# EAGLE design MEMS_BMI (EAGLE 7.6.0)

## Sheet 1 of 4: power
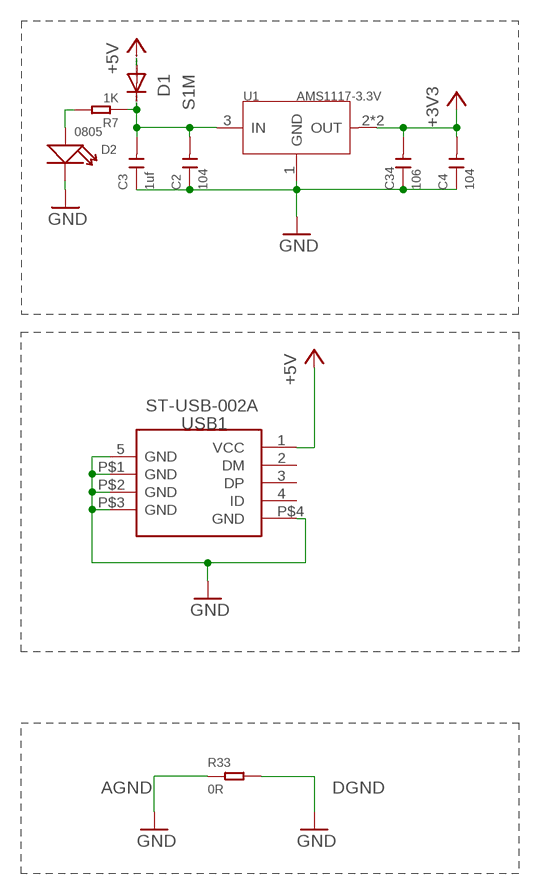
[diagram p0: schematic, sheet 1]

### Parts
C2  104  CAP-(0603)  [C0603]
C3  1uf  CERAMIC-1UF-25V-10%-X7R(0805)  [C0805]
C4  104  CAP-(0603)  [C0603]
C34  106  CERAMIC-1UF-25V-10%-X7R(0805)  [C0805]
D1  S1M  [SMA]
D2  0805  SMD-LED-CLEAR-RED(0805)  [LED-0805]
R7  1K  RES-(0603)  [R0603]
R33  0R  RES-(0603)  [R0603]
U1  AMS1117-3.3V  PMIC-CJT1117-3.3(SOT223)  [SOT-223]
USB1  ST-USB-002A  MINI-USB-RCPT-B-5PS-R/A-SMD(ST-USB-002A)  [MINIUSB5+4P-SMD-0.8-90D]

### Nets
+3V3: C4.2 C34.2 U1.2(OUT) U1.TER(OUT) ; also sheet 2,3
+5V: D1.A USB1.1(VCC)
GND: C2.1 C3.1 C4.1 C34.1 D2.- R33.1 R33.2 U1.1(GND) USB1.5(GND) USB1.P$1(GND) USB1.P$2(GND) USB1.P$3(GND) USB1.P$4(GND) ; also sheet 2,3,4
N$4: C2.2 C3.2 D1.C R7.1 U1.3(IN)
N$12: D2.+ R7.2
Unconnected: USB1.2(DM) USB1.3(DP) USB1.4(ID)

### Notes on the sheet
- AGND | DGND

## Sheet 2 of 4: main
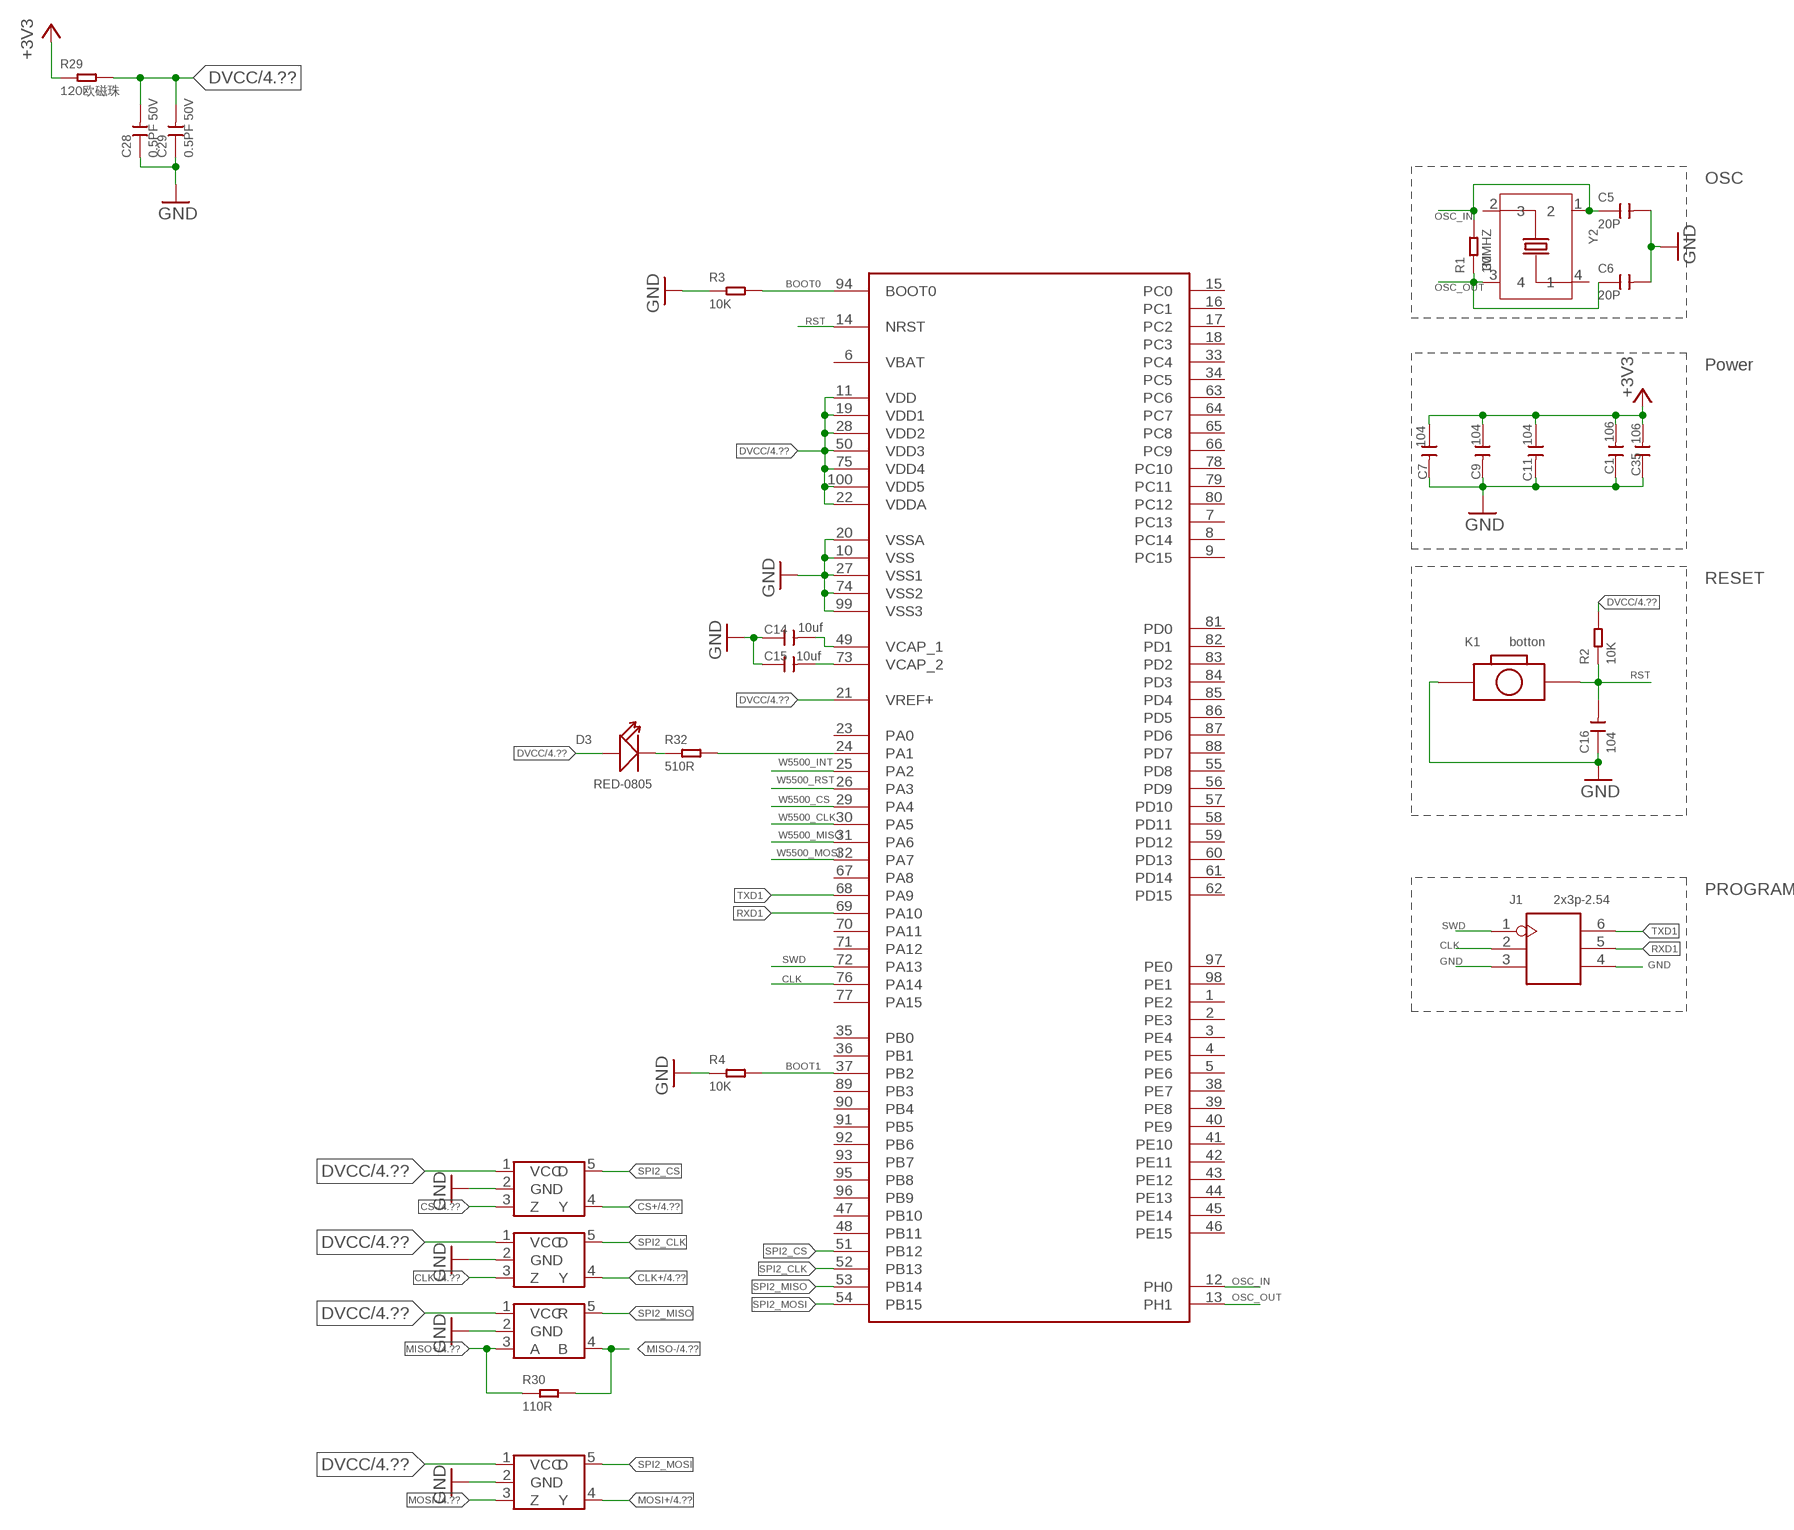
[diagram p1: schematic, sheet 2]

### Parts
C1  106  CERAMIC-1UF-25V-10%-X7R(0805)  [C0805]
C5  20P  CAP-(0603)  [C0603]
C6  20P  CAP-(0603)  [C0603]
C7  104  CAP-(0603)  [C0603]
C9  104  CAP-(0603)  [C0603]
C11  104  CAP-(0603)  [C0603]
C14  10uf  CERAMIC-1UF-25V-10%-X7R(0805)  [C0805]
C15  10uf  CERAMIC-1UF-25V-10%-X7R(0805)  [C0805]
C16  104  CAP-(0603)  [C0603]
C28  0.5PF 50V  CAP-(0603)  [C0603]
C29  0.5PF 50V  CAP-(0603)  [C0603]
C35  106  CERAMIC-1UF-25V-10%-X7R(0805)  [C0805]
D3  RED-0805  SMD-LED-CLEAR-RED(0805)  [LED-0805]
J1  2x3p-2.54  DIP-BLACK-FEMALE-HEADER-VERT(2X3P-2.54)  [H2X3-2.54]
K1  botton  SMD-BUTTON  [SW2-SMD-3.0X6.0*2.5]
LVDS1-1  SN65LVDS1  [DBV_R-PDSO-G5]
LVDS1-2  SN65LVDS1  [DBV_R-PDSO-G5]
LVDS1-3  SN65LVDS1  [DBV_R-PDSO-G5]
R1  1M  RES-(0603)  [R0603]
R2  10K  RES-(0603)  [R0603]
R3  10K  RES-(0603)  [R0603]
R4  10K  RES-(0603)  [R0603]
R29  120欧磁珠  RES-(0603)  [R0603]
R30  110R  RES-(0603)  [R0603]
R32  510R  RES-(0603)  [R0603]
U$1  STM32F40XSTM32D40X  [LQFP100]
U$2  SN65LVDS2  [DBV_R-PDSO-G5]
Y2  30MHZ  SMD-CRYSTAL-30MHZ-10PF-10PPM-60R(4P-3.2X2.5MM)  [X4-SMD-3.2X2.5X0.7MM]

### Nets
+3V3: C1.2 C7.1 C9.1 C11.1 C35.2 R29.1 ; also sheet 1,3
BOOT0: R3.2 U$1.94(BOOT0)
BOOT1: R4.2 U$1.37(PB2)
CLK: J1.2 U$1.76(PA14)
CLK+: LVDS1-2.4(Y) ; also sheet 4
CLK-: LVDS1-2.3(Z) ; also sheet 4
CS+: LVDS1-1.4(Y) ; also sheet 4
CS-: LVDS1-1.3(Z) ; also sheet 4
DVCC: C28.2 C29.2 D3.+ LVDS1-1.1(VCC) LVDS1-2.1(VCC) LVDS1-3.1(VCC) R2.2 R29.2 U$1.11(VDD) U$1.19(VDD1) U$1.21(VREF+) U$1.22(VDDA) U$1.28(VDD2) U$1.50(VDD3) U$1.75(VDD4) U$1.100(VDD5) U$2.1(VCC) ; also sheet 4
GND: C1.1 C5.2 C6.2 C7.2 C9.2 C11.2 C14.1 C15.1 C16.1 C28.1 C29.1 C35.1 J1.3 J1.4 K1.1 LVDS1-1.2(GND) LVDS1-2.2(GND) LVDS1-3.2(GND) R3.1 R4.1 U$1.10(VSS) U$1.20(VSSA) U$1.27(VSS1) U$1.74(VSS2) U$1.99(VSS3) U$2.2(GND) ; also sheet 1,3,4
MISO+: R30.1 U$2.3(A) ; also sheet 4
MISO-: R30.2 U$2.4(B) ; also sheet 4
MOSI+: LVDS1-3.4(Y) ; also sheet 4
MOSI-: LVDS1-3.3(Z) ; also sheet 4
N$1: C15.2 U$1.73(VCAP_2)
N$8: C14.2 U$1.49(VCAP_1)
N$26: D3.- R32.1
N$28: R32.2 U$1.24(PA1)
OSC_IN: C5.1 R1.2 U$1.12(PH0) Y2.1
OSC_OUT: C6.1 R1.1 U$1.13(PH1) Y2.3
RST: C16.2 K1.2 R2.1 U$1.14(NRST)
RXD1: J1.5 U$1.69(PA10)
SPI2_CLK: LVDS1-2.5(D) U$1.52(PB13)
SPI2_CS: LVDS1-1.5(D) U$1.51(PB12)
SPI2_MISO: U$1.53(PB14) U$2.5(R)
SPI2_MOSI: LVDS1-3.5(D) U$1.54(PB15)
SWD: J1.1 U$1.72(PA13)
TXD1: J1.6 U$1.68(PA9)
W5500_CLK: U$1.30(PA5) ; also sheet 3
W5500_CS: U$1.29(PA4) ; also sheet 3
W5500_INT: U$1.25(PA2) ; also sheet 3
W5500_MISO: U$1.31(PA6) ; also sheet 3
W5500_MOSI: U$1.32(PA7) ; also sheet 3
W5500_RST: U$1.26(PA3) ; also sheet 3
Unconnected: U$1.1(PE2) U$1.2(PE3) U$1.3(PE4) U$1.4(PE5) U$1.5(PE6) U$1.6(VBAT) U$1.7(PC13) U$1.8(PC14) U$1.9(PC15) U$1.15(PC0) U$1.16(PC1) U$1.17(PC2) U$1.18(PC3) U$1.23(PA0) U$1.33(PC4) U$1.34(PC5) U$1.35(PB0) U$1.36(PB1) U$1.38(PE7) U$1.39(PE8) U$1.40(PE9) U$1.41(PE10) U$1.42(PE11) U$1.43(PE12) U$1.44(PE13) U$1.45(PE14) U$1.46(PE15) U$1.47(PB10) U$1.48(PB11) U$1.55(PD8) U$1.56(PD9) U$1.57(PD10) U$1.58(PD11) U$1.59(PD12) U$1.60(PD13) U$1.61(PD14) U$1.62(PD15) U$1.63(PC6) U$1.64(PC7) U$1.65(PC8) U$1.66(PC9) U$1.67(PA8) U$1.70(PA11) U$1.71(PA12) U$1.77(PA15) U$1.78(PC10) U$1.79(PC11) U$1.80(PC12) U$1.81(PD0) U$1.82(PD1) U$1.83(PD2) U$1.84(PD3) U$1.85(PD4) U$1.86(PD5) U$1.87(PD6) U$1.88(PD7) U$1.89(PB3) U$1.90(PB4) U$1.91(PB5) U$1.92(PB6) U$1.93(PB7) U$1.95(PB8) U$1.96(PB9) U$1.97(PE0) U$1.98(PE1) Y2.2 Y2.4

### Notes on the sheet
- OSC
- Power
- RESET
- PROGRAM

## Sheet 3 of 4: W5500
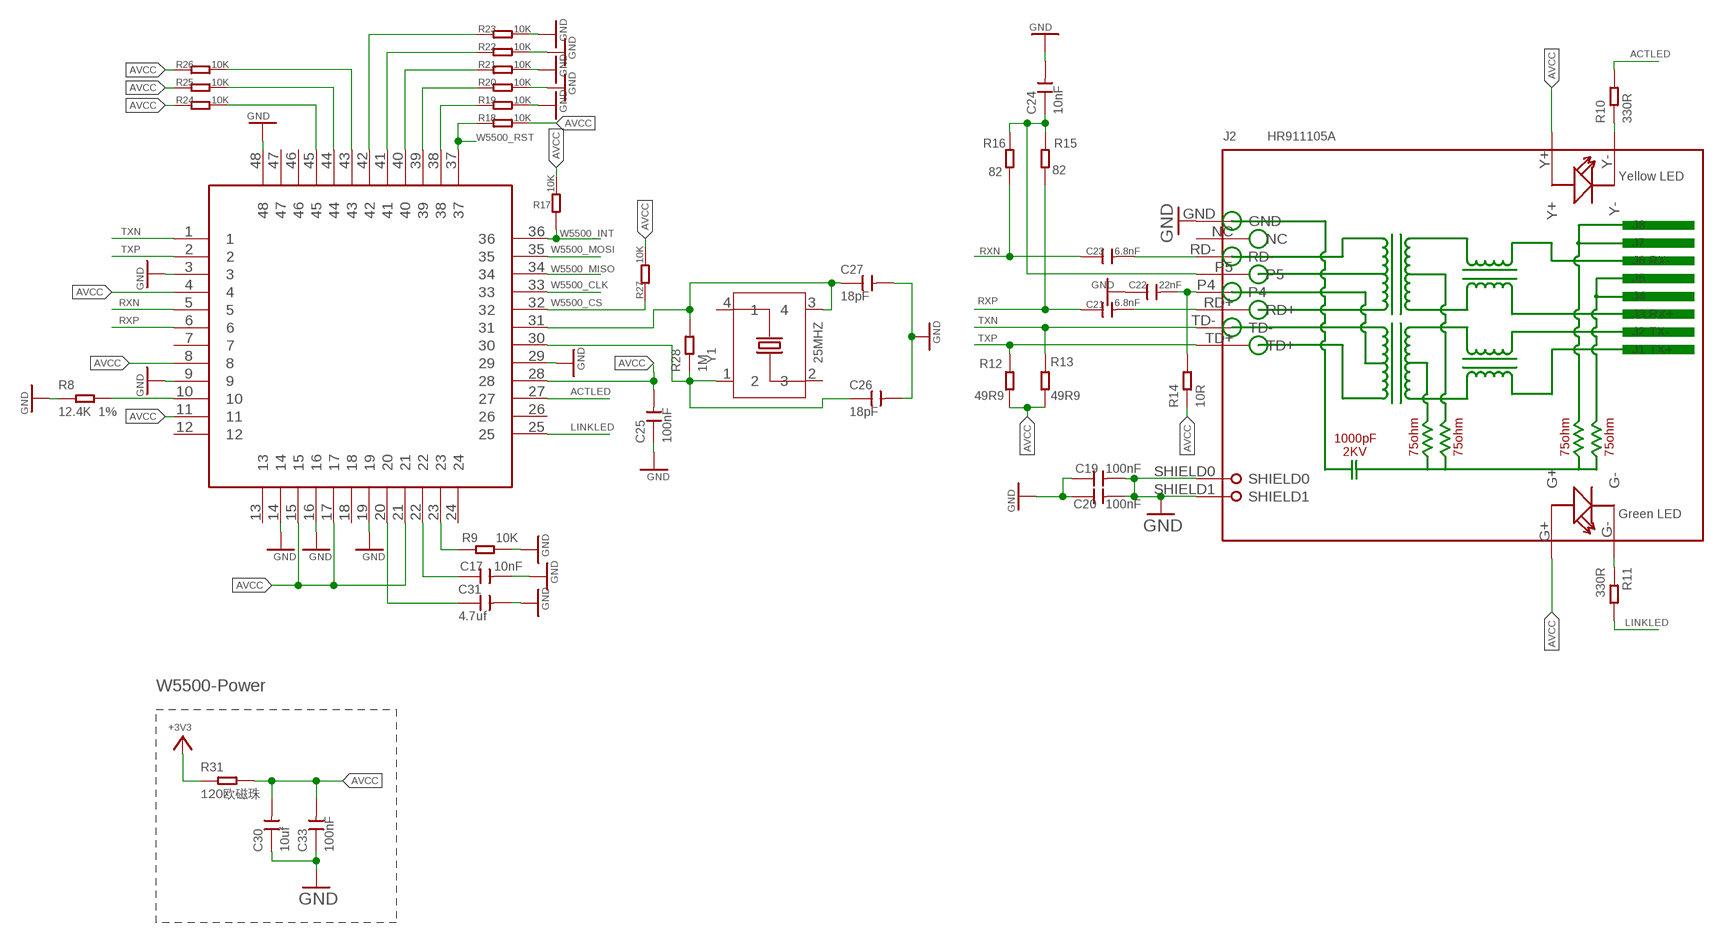
[diagram p2: schematic, sheet 3]

### Parts
C17  10nF  CAP-(0603)  [C0603]
C19  100nF  CAP-(0603)  [C0603]
C20  100nF  CAP-(0603)  [C0603]
C21  6.8nF  CAP-(0603)  [C0603]
C22  22nF  CAP-(0603)  [C0603]
C23  6.8nF  CAP-(0603)  [C0603]
C24  10nF  CAP-(0603)  [C0603]
C25  100nF  CAP-(0603)  [C0603]
C26  18pF  CAP-(0603)  [C0603]
C27  18pF  CAP-(0603)  [C0603]
C30  10uf  CERAMIC-1UF-25V-10%-X7R(0805)  [C0805]
C31  4.7uf  CERAMIC-1UF-25V-10%-X7R(0805)  [C0805]
C33  100nF  CAP-(0603)  [C0603]
J2  HR911105A  DIP-RJ45-CONNECTOR(HR911105A)  [RJ45-12+2P-21.3X16.04X13.4MM]
R8  12.4K 1%  RES-(0603)  [R0603]
R9  10K  RES-(0603)  [R0603]
R10  330R  RES-(0603)  [R0603]
R11  330R  RES-(0603)  [R0603]
R12  49R9  RES-(0603)  [R0603]
R13  49R9  RES-(0603)  [R0603]
R14  10R  RES-(0603)  [R0603]
R15  82  RES-(0603)  [R0603]
R16  82  RES-(0603)  [R0603]
R17  10K  RES-(0603)  [R0603]
R18  10K  RES-(0603)  [R0603]
R19  10K  RES-(0603)  [R0603]
R20  10K  RES-(0603)  [R0603]
R21  10K  RES-(0603)  [R0603]
R22  10K  RES-(0603)  [R0603]
R23  10K  RES-(0603)  [R0603]
R24  10K  RES-(0603)  [R0603]
R25  10K  RES-(0603)  [R0603]
R26  10K  RES-(0603)  [R0603]
R27  10K  RES-(0603)  [R0603]
R28  1M  RES-(0603)  [R0603]
R31  120欧磁珠  RES-(0603)  [R0603]
W5500-1  W5500  [LQFP48]
Y1  25MHZ  SMD-CRYSTAL-30MHZ-10PF-10PPM-60R(4P-3.2X2.5MM)  [X4-SMD-3.2X2.5X0.7MM]

### Nets
+3V3: R31.1 ; also sheet 1,2
ACTLED: R10.2 W5500-1.27
AVCC: C25.2 C30.2 C33.2 J2.G+ J2.Y+ R12.1 R13.1 R14.1 R17.2 R18.2 R24.1 R25.1 R26.1 R27.2 R31.2 W5500-1.4 W5500-1.8 W5500-1.11 W5500-1.15 W5500-1.17 W5500-1.21 W5500-1.28
GND: C17.2 C19.1 C19.2 C20.1 C20.2 C22.1 C24.2 C25.1 C26.2 C27.2 C30.1 C31.2 C33.1 J2.GND J2.SHIELD0 J2.SHIELD1 R8.1 R9.2 R19.2 R20.2 R21.2 R22.2 R23.2 W5500-1.3 W5500-1.9 W5500-1.14 W5500-1.16 W5500-1.19 W5500-1.29 W5500-1.48 ; also sheet 1,2,4
LINKLED: R11.2 W5500-1.25
N$5: R9.1 W5500-1.23
N$6: C17.1 W5500-1.22
N$7: C31.1 W5500-1.20
N$9: J2.G- R11.1
N$10: J2.Y- R10.1
N$11: R24.2 W5500-1.45
N$13: R8.2 W5500-1.10
N$14: R25.2 W5500-1.44
N$15: C21.2 J2.RD+
N$16: C22.2 J2.P4 R14.2
N$17: R26.2 W5500-1.43
N$18: C23.2 J2.RD-
N$19: C27.1 R28.2 W5500-1.31 Y1.3
N$20: R19.1 W5500-1.38
N$21: C24.1 J2.P5 R15.2 R16.2
N$22: R20.1 W5500-1.39
N$23: R21.1 W5500-1.40
N$24: R22.1 W5500-1.41
N$25: R23.1 W5500-1.42
N$27: C26.1 R28.1 W5500-1.30 Y1.1
RXN: C23.1 R16.1 W5500-1.5
RXP: C21.1 R15.1 W5500-1.6
TXN: J2.TD- R13.2 W5500-1.1
TXP: J2.TD+ R12.2 W5500-1.2
W5500_CLK: W5500-1.33 ; also sheet 2
W5500_CS: R27.1 W5500-1.32 ; also sheet 2
W5500_INT: R17.1 W5500-1.36 ; also sheet 2
W5500_MISO: W5500-1.34 ; also sheet 2
W5500_MOSI: W5500-1.35 ; also sheet 2
W5500_RST: R18.1 W5500-1.37 ; also sheet 2
Unconnected: J2.NC W5500-1.7 W5500-1.12 W5500-1.13 W5500-1.18 W5500-1.24 W5500-1.26 W5500-1.46 W5500-1.47 Y1.2 Y1.4

### Notes on the sheet
- W5500-Power

## Sheet 4 of 4: intan
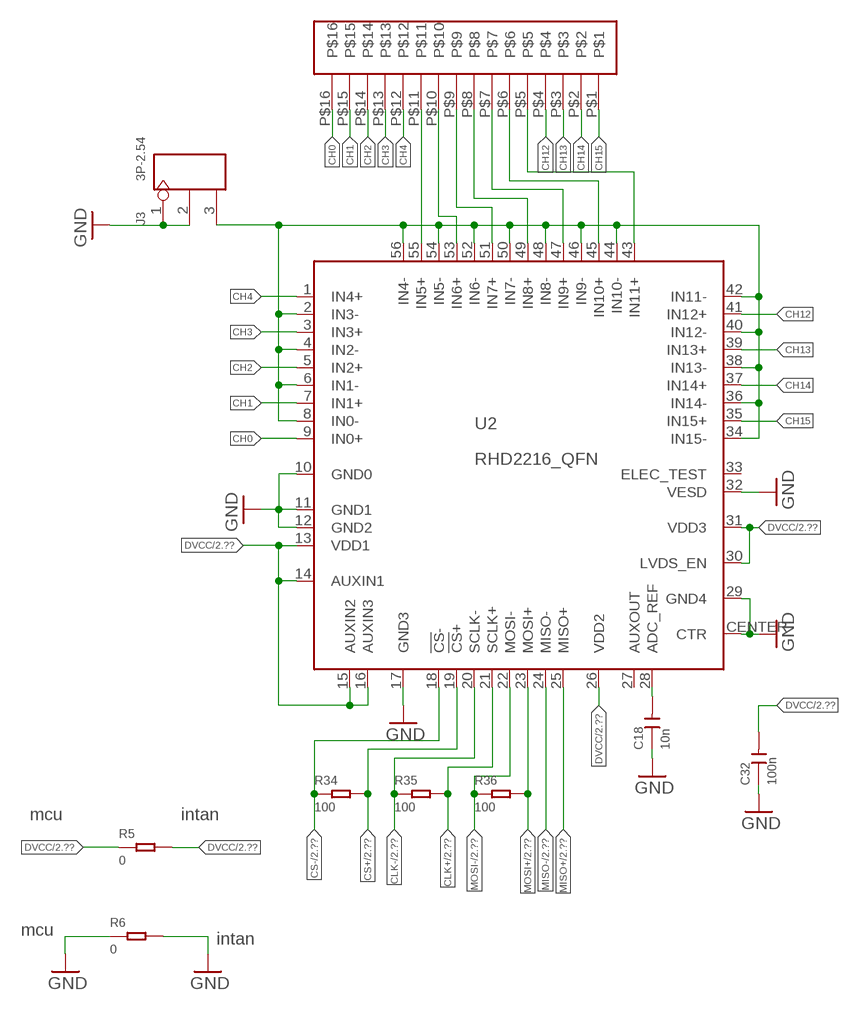
[diagram p3: schematic, sheet 4]

### Parts
C18  10n  CAP-(0603)  [C0603]
C32  100n  CAP-(0603)  [C0603]
J3  3P-2.54  DIP-WHITE-MALE-HEADER-VERT(3P-2.54)  [H3-2.54]
R5  0  RES-(0603)  [R0603]
R6  0  RES-(0603)  [R0603]
R34  100  RES-(0603)  [R0603]
R35  100  RES-(0603)  [R0603]
R36  100  RES-(0603)  [R0603]
U2  RHD2216_QFN  [QFN56_8_X_8_LARGE]
U$3  PROBE  [PROBE-16-PIN]

### Nets
CH0: U2.9(IN0+) U$3.P$16
CH1: U2.7(IN1+) U$3.P$15
CH2: U2.5(IN2+) U$3.P$14
CH3: U2.3(IN3+) U$3.P$13
CH4: U2.1(IN4+) U$3.P$12
CH12: U2.41(IN12+) U$3.P$4
CH13: U2.39(IN13+) U$3.P$3
CH14: U2.37(IN14+) U$3.P$2
CH15: U2.35(IN15+) U$3.P$1
CLK+: R35.2 U2.21(SCLK+) ; also sheet 2
CLK-: R35.1 U2.20(SCLK-) ; also sheet 2
CS+: R34.2 U2.19(!CS!+) ; also sheet 2
CS-: R34.1 U2.18(!CS!-) ; also sheet 2
DVCC: C32.2 R5.1 R5.2 U2.13(VDD1) U2.14(AUXIN1) U2.15(AUXIN2) U2.16(AUXIN3) U2.26(VDD2) U2.30(LVDS_EN) U2.31(VDD3) ; also sheet 2
GND: C18.1 C32.1 J3.1 J3.2 R6.1 R6.2 U2.10(GND0) U2.11(GND1) U2.12(GND2) U2.17(GND3) U2.29(GND4) U2.32(VESD) U2.CENTER(CTR) ; also sheet 1,2,3
MISO+: U2.25(MISO+) ; also sheet 2
MISO-: U2.24(MISO-) ; also sheet 2
MOSI+: R36.2 U2.23(MOSI+) ; also sheet 2
MOSI-: R36.1 U2.22(MOSI-) ; also sheet 2
N$30: C18.2 U2.28(ADC_REF)
N$36: J3.3 U2.2(IN3-) U2.4(IN2-) U2.6(IN1-) U2.8(IN0-) U2.34(IN15-) U2.36(IN14-) U2.38(IN13-) U2.40(IN12-) U2.42(IN11-) U2.44(IN10-) U2.46(IN9-) U2.48(IN8-) U2.50(IN7-) U2.52(IN6-) U2.54(IN5-) U2.56(IN4-)
N$37: U2.55(IN5+) U$3.P$11
N$38: U2.53(IN6+) U$3.P$10
N$39: U2.51(IN7+) U$3.P$9
N$40: U2.49(IN8+) U$3.P$8
N$41: U2.47(IN9+) U$3.P$7
N$42: U2.45(IN10+) U$3.P$6
N$43: U2.43(IN11+) U$3.P$5
Unconnected: U2.27(AUXOUT) U2.33(ELEC_TEST)

### Notes on the sheet
- mcu | intan
- mcu
- intan

## Library data of the parts
C1 C14 C15 C30 C31 C34 C35 = Seeed-OPL-Capacitor:CERAMIC-1UF-25V-10%-X7R(0805): 302010179; MPN: CC0805KKX7R8BB105; VALUE: 1uf
C2 C4-C7 C9 C11 C16-C27 C32 C33 = 1-intan:CAP-(0603): 302010115; VALUE: 0.5PF 50V
C3 = Seeed-OPL-Capacitor:CERAMIC-1UF-25V-10%-X7R(0805): 302010179; MPN: CC0805KKX7R8BB105
C28 C29 = 1-intan:CAP-(0603): 302010115
D1 = diode:S1M
D2 = Seeed-OPL-Diode:SMD-LED-CLEAR-RED(0805): 304090046; MPN: 17-215SURC/S530-A2/TR8; VALUE: RED-0805
D3 = Seeed-OPL-Diode:SMD-LED-CLEAR-RED(0805): 304090046; MPN: 17-215SURC/S530-A2/TR8
J1 = Seeed-OPL-Connector:DIP-BLACK-FEMALE-HEADER-VERT(2X3P-2.54): 320030011; MPN: F185-1203A1BSYA1
J2 = Seeed-OPL-Connector:DIP-RJ45-CONNECTOR(HR911105A): 320140005; MPN: HR911105A
J3 = Seeed-OPL-Connector:DIP-WHITE-MALE-HEADER-VERT(3P-2.54): 320020038; MPN: P125-1103A0BS116A1
K1 = 1-intan:SMD-BUTTON: 311020047; MPN: B3U-1000P; VALUE: B3U-1000P
LVDS1-1-LVDS1-3 = 1-intan:SN65LVDS1
R1-R36 = 1-intan:RES-(0603): 301010236; MPN: RC0603FR-071M1L; VALUE: 1.1M 1/10W
U1 = 1-intan:PMIC-CJT1117-3.3(SOT223): 310030097; MPN: CJT1117-3.3; VALUE: CJT1117-3.3-SOT223
U2 = RHD2000:RHD2216: Intan Technologies RHD2216 chip
U$1 = 1-intan:STM32F40X: Features • Core: ARM 32-bit Cortex™-M4 CPU with FPU, Adaptive real-time accelerator (ART Accelerator™) allowing 0-wait state execution from Flash memory, frequency up to 168 MHz, memory protection unit, 210 DMIPS/ 1.25 DMIPS/MHz (Dhrystone 2.1), and DSP instructions • Memories – Up to 1 Mbyte of Flash memory – Up to 192+4 Kbytes of SRAM including 64- Kbyte of CCM (core coupled memory) data RAM – Flexible static memory controller supporting Compact Flash, SRAM, PSRAM, NOR and NAND memories • LCD parallel interface, 8080/6800 modes • Clock, reset and supply management – 1.8 V to 3.6 V application supply and I/Os – POR, PDR, PVD and BOR – 4-to-26 MHz crystal oscillator – Internal 16 MHz factory-trimmed RC (1% accuracy) – 32 kHz oscillator for RTC with calibration – Internal 32 kHz RC with calibration • Low power – Sleep, Stop and Standby modes – VBAT supply for RTC, 20×32 bit backup registers + optional 4 KB backup SRAM • 3×12-bit, 2.4 MSPS A/D converters: up to 24 channels and 7.2 MSPS in triple interleaved mode • 2×12-bit D/A converters • General-purpose DMA: 16-stream DMA controller with FIFOs and burst support • Up to 17 timers: up to twelve 16-bit and two 32- bit timers up to 168 MHz, each with up to 4 IC/OC/PWM or pulse counter and quadrature (incremental) encoder input • Debug mode – Serial wire debug (SWD) & JTAG interfaces – Cortex-M4 Embedded Trace Macrocell™ • Up to 140 I/O ports with interrupt capability – Up to 136 fast I/Os up to 84 MHz – Up to 138 5 V-tolerant I/Os • Up to 15 communication interfaces – Up to 3 × I2C interfaces (SMBus/PMBus) – Up to 4 USARTs/2 UARTs (10.5 Mbit/s, ISO 7816 interface, LIN, IrDA, modem control) – Up to 3 SPIs (42 Mbits/s), 2 with muxed full-duplex I2S to achieve audio class accuracy via internal audio PLL or external clock – 2 × CAN interfaces (2.0B Active) – SDIO interface • Advanced connectivity – USB 2.0 full-speed device/host/OTG controller with on-chip PHY – USB 2.0 high-speed/full-speed device/host/OTG controller with dedicated DMA, on-chip full-speed PHY and ULPI – 10/100 Ethernet MAC with dedicated DMA: supports IEEE 1588v2 hardware, MII/RMII • 8- to 14-bit parallel camera interface up to 54 Mbytes/s • True random number generator • CRC calculation unit • 96-bit unique ID • RTC: subsecond accuracy, hardware calendar
U$2 = 1-intan:SN65LVDS2
U$3 = 1-intan:PROBE
USB1 = Seeed-OPL-Connector:MINI-USB-RCPT-B-5PS-R/A-SMD(ST-USB-002A): 320010013; MPN: ST-USB-002A
W5500-1 = 1-intan:W5500
Y1 = Seeed-OPL-Crystal-Oscillator:SMD-CRYSTAL-30MHZ-10PF-10PPM-60R(4P-3.2X2.5MM): 306010035; MPN: 7M30000024; VALUE: 30MHZ
Y2 = Seeed-OPL-Crystal-Oscillator:SMD-CRYSTAL-30MHZ-10PF-10PPM-60R(4P-3.2X2.5MM): 306010035; MPN: 7M30000024

## Board
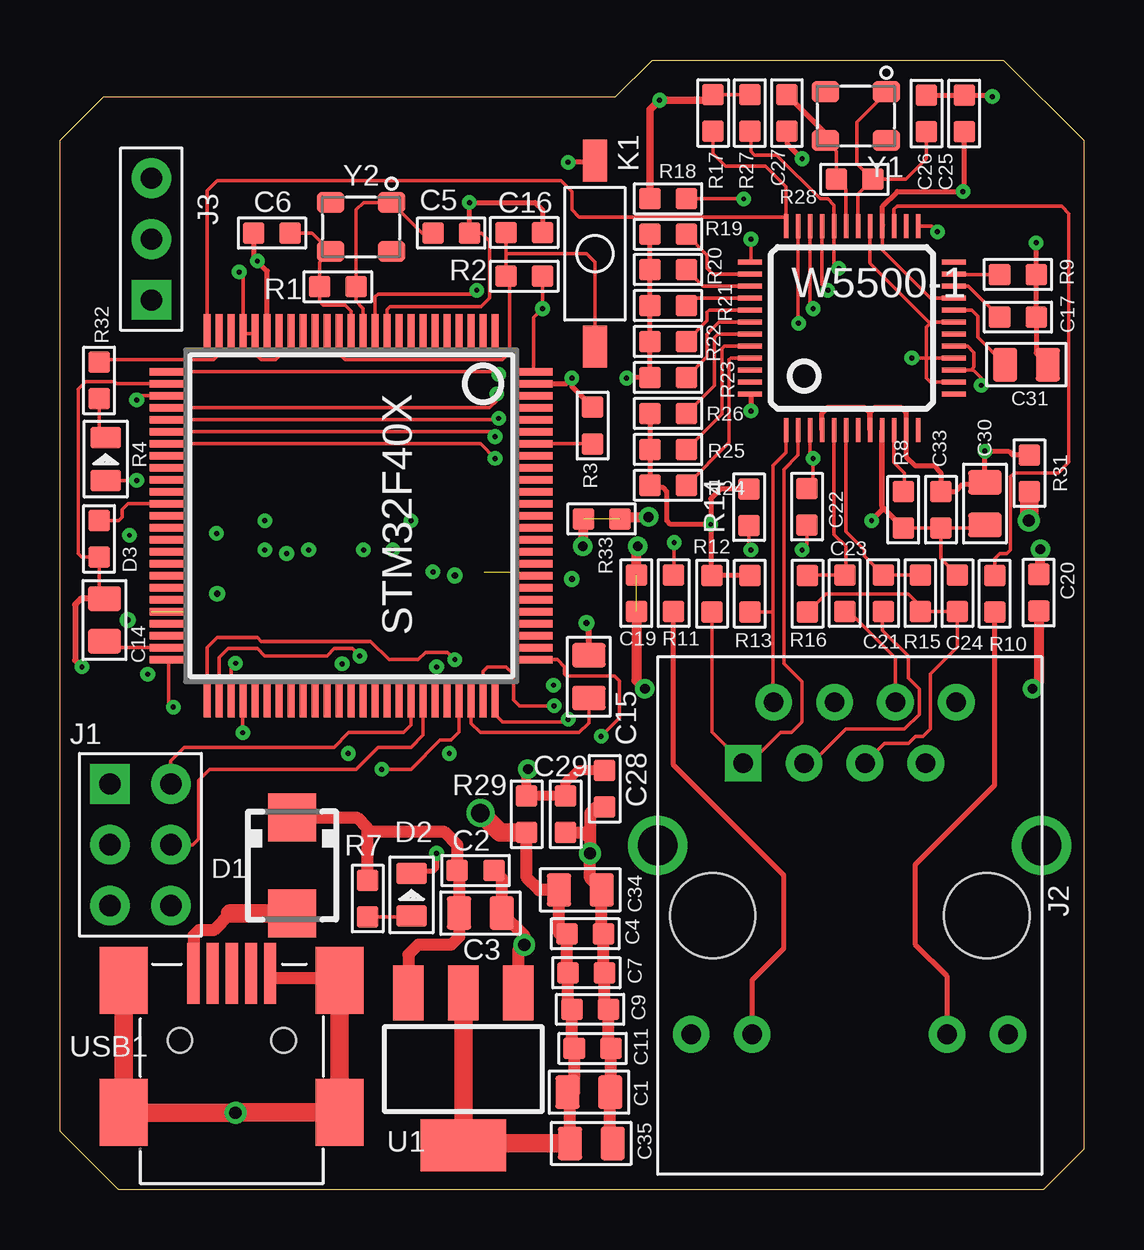
[diagram p4: board, top side]
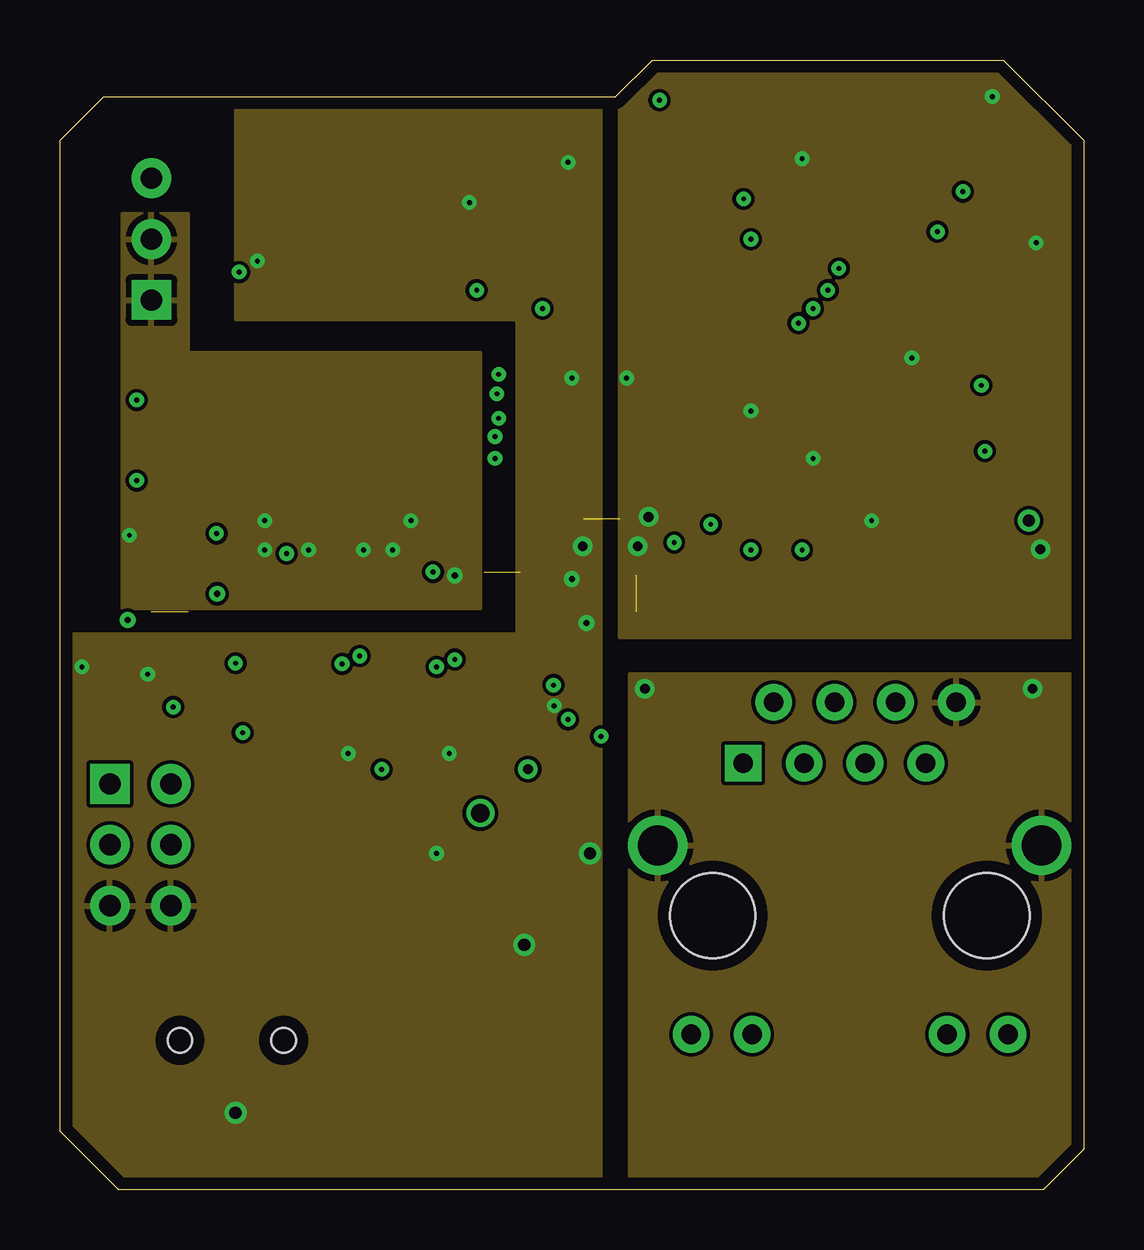
[diagram p5: board, inner layer GND]
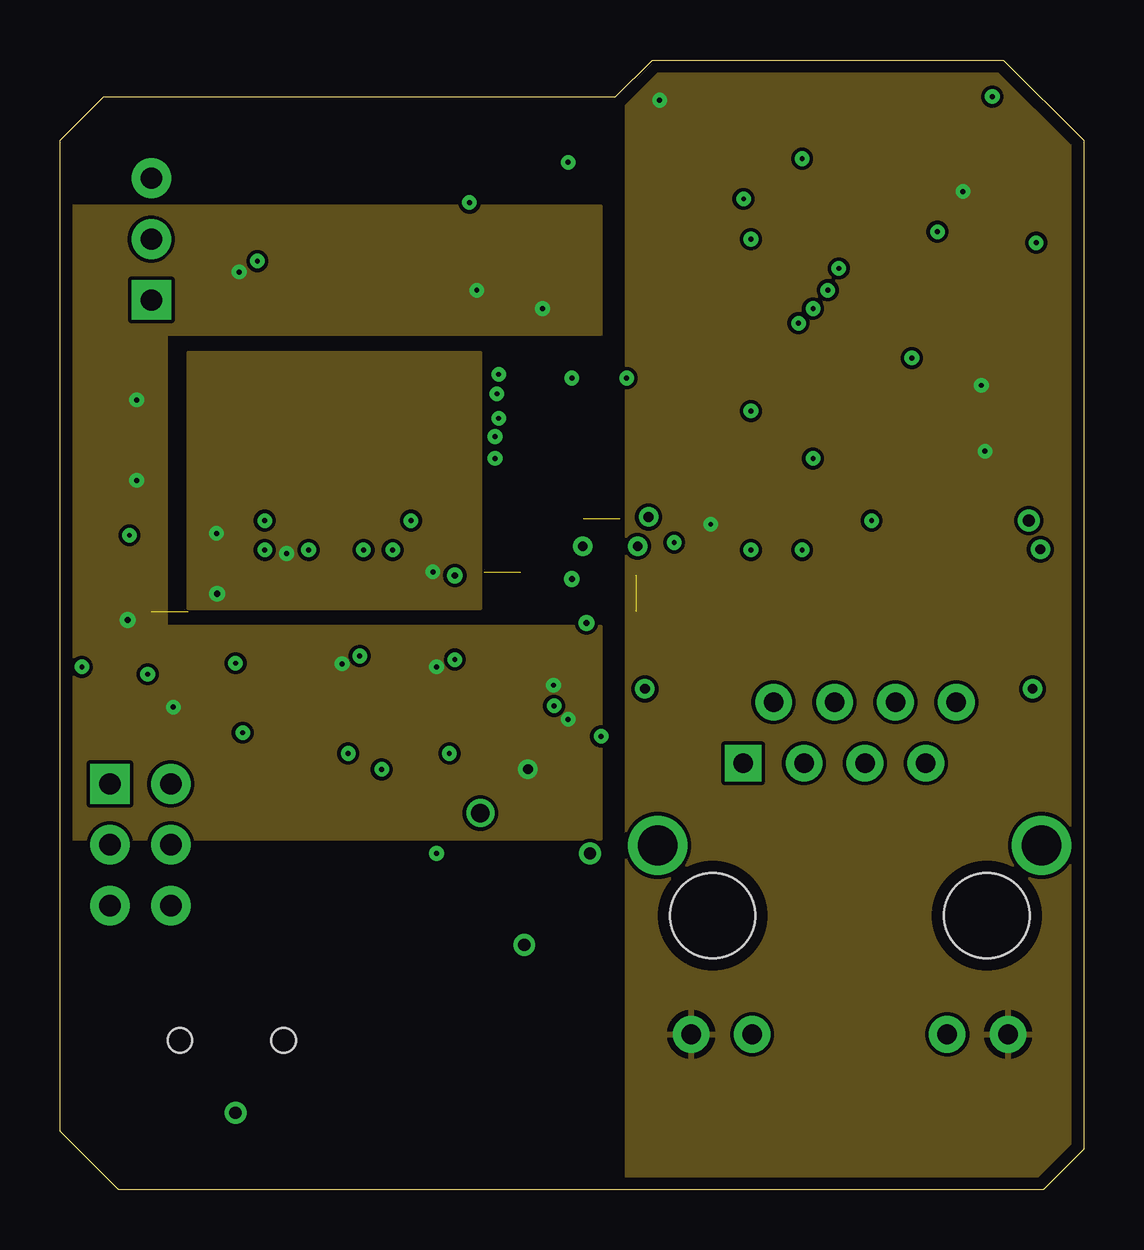
[diagram p6: board, inner layer VCC]
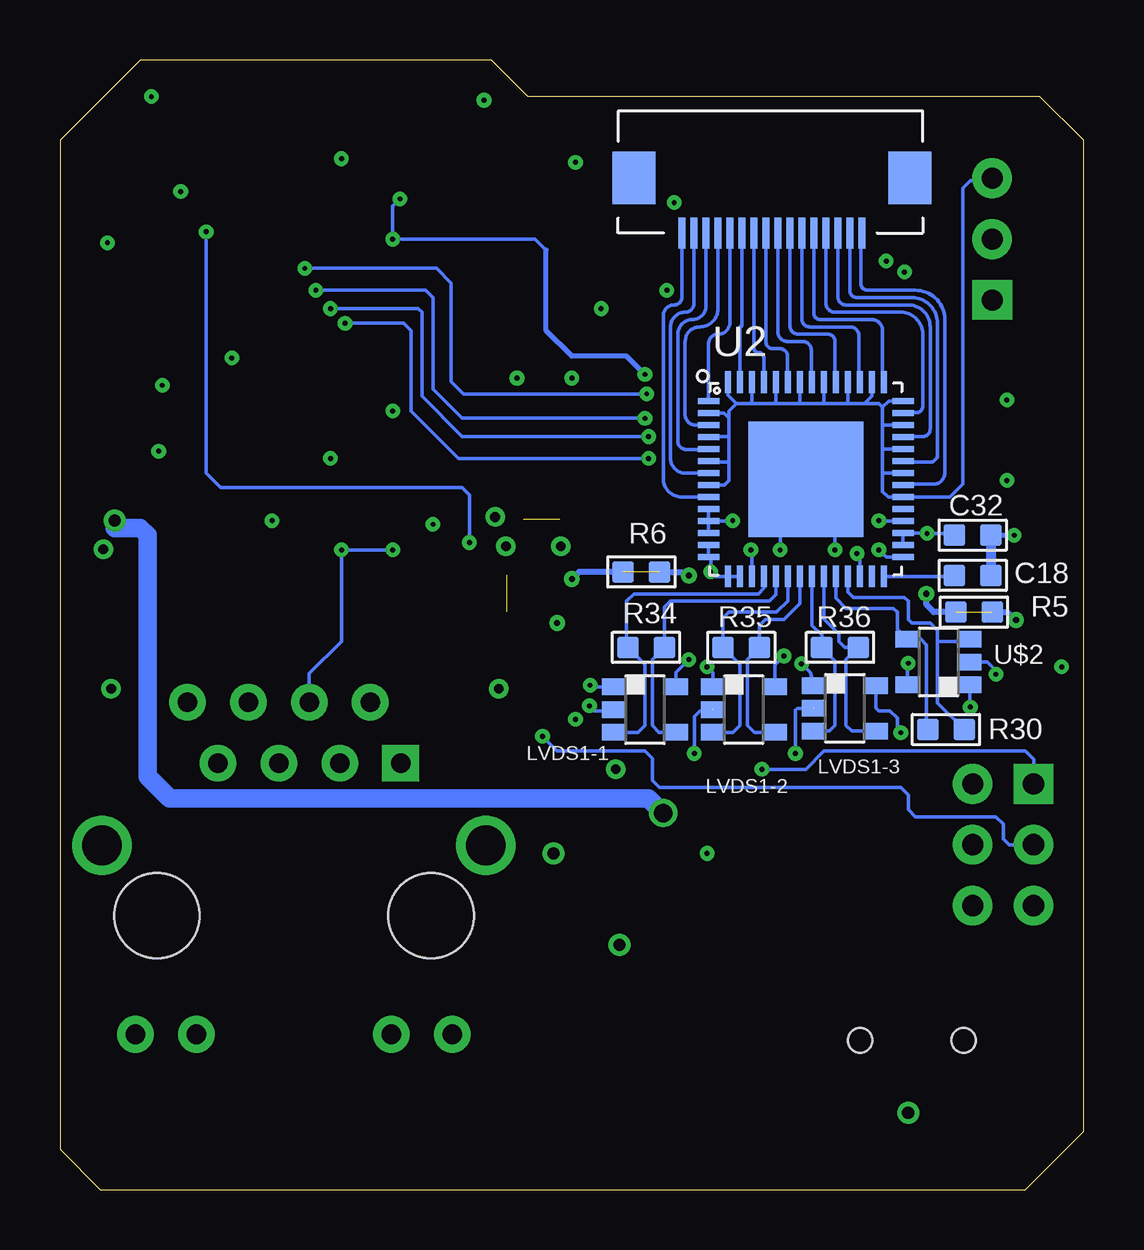
[diagram p7: board, bottom side, seen from below]

Size 42.67 x 47.09 mm. Coordinates in mm from the lower left corner, seen from the top.
Outline: 42.67,43.74 42.67,1.68 41,0 2.44,0 0,2.44 0,43.74 1.83,45.57 23.17,45.57 24.69,47.09 39.32,47.09 42.67,43.74
Copper layers (1*2+3*16): Top 0.035mm / dielectric 0.6mm / GND 0.035mm / dielectric 0.15mm / VCC 0.035mm / dielectric 0.2mm / Bottom 0.035mm
Design rules "default *": minimum track width 6mil, minimum drill 8mil, track to track 6mil, track to pad 6mil, pad to pad 6mil, via to via 6mil, smd to smd 6mil, copper to edge 20mil, drill to drill 8mil, minimum pad ring 10mil, minimum via ring 8mil, stop-mask expansion 4mil, vias tented up to drill 1mil, thermal gap 10mil

### Footprints (pad centres in the part's own frame; a part is rotated, then mirrored left to right if it is on the bottom)
C0805 = smd 1.397 x 1.016: 1 0,0.889; 2 0,-0.889
C0603 = smd 0.889 x 0.889: 1 0,0.762; 2 0,-0.762
SMA = smd 2 x 2: A 2,0; C -2,0
LED-0805 = smd 0.889 x 1.27: + -0.889,0; - 0.889,0
H2X3-2.54 = drill 0.889 pad 1.651 square: 1 -1.27,2.54 | drill 0.889 pad 1.651: 2 -1.27,0; 3 -1.27,-2.54; 4 1.27,-2.54; 5 1.27,0; 6 1.27,2.54
RJ45-12+2P-21.3X16.04X13.4MM = drill 0.813 pad 1.524: G+ 4.953,-6.604; G- 4.953,-4.064; GND -8.89,4.445; NC -6.35,3.175; P4 -8.89,-0.635; P5 -6.35,0.635; RD+ -6.35,-1.905; RD- -8.89,1.905; TD- -8.89,-3.175; Y+ 4.953,6.604; Y- 4.953,4.064 | drill 1.651 pad 2.159: SHIELD0 -2.921,8.001; SHIELD1 -2.921,-8.001 | drill 0.813 pad 1.524 square: TD+ -6.35,-4.445 | hole 3.556: 0,-5.715; 0,5.715
H3-2.54 = drill 0.889 pad 1.651 square: 1 0,2.54 | drill 0.889 pad 1.651: 2 0,0; 3 0,-2.54
SW2-SMD-3.0X6.0*2.5 = smd 1.75 x 1: 1 -3.875,0; 2 3.875,0
DBV_R-PDSO-G5 = smd 0.69 x 0.99: 1 -0.95,-1.29; 2 0,-1.29; 3 0.95,-1.29; 4 0.95,1.3; 5 -0.95,1.3
R0603 = smd 0.889 x 0.889: 1 0,0.762; 2 0,-0.762
SOT-223 = smd 1.27 x 2.286: 1 -2.286,-3.175; 2 0,-3.175; 3 2.286,-3.175 | smd 3.556 x 2.159: TER 0,3.175
QFN56_8_X_8_LARGE = smd 0.9 x 0.25: 1 -4.05,3.25; 2 -4.05,2.75; 3 -4.05,2.25; 4 -4.05,1.75; 5 -4.05,1.25; 6 -4.05,0.75; 7 -4.05,0.25; 8 -4.05,-0.25; 9 -4.05,-0.75; 10 -4.05,-1.25; 11 -4.05,-1.75; 12 -4.05,-2.25; 13 -4.05,-2.75; 14 -4.05,-3.25; 29 4.05,-3.25; 30 4.05,-2.75; 31 4.05,-2.25; 32 4.05,-1.75; 33 4.05,-1.25; 34 4.05,-0.75; 35 4.05,-0.25; 36 4.05,0.25; 37 4.05,0.75; 38 4.05,1.25; 39 4.05,1.75; 40 4.05,2.25; 41 4.05,2.75; 42 4.05,3.25 | smd 0.25 x 0.9: 15 -3.25,-4.05; 16 -2.75,-4.05; 17 -2.25,-4.05; 18 -1.75,-4.05; 19 -1.25,-4.05; 20 -0.75,-4.05; 21 -0.25,-4.05; 22 0.25,-4.05; 23 0.75,-4.05; 24 1.25,-4.05; 25 1.75,-4.05; 26 2.25,-4.05; 27 2.75,-4.05; 28 3.25,-4.05; 43 3.25,4.05; 44 2.75,4.05; 45 2.25,4.05; 46 1.75,4.05; 47 1.25,4.05; 48 0.75,4.05; 49 0.25,4.05; 50 -0.25,4.05; 51 -0.75,4.05; 52 -1.25,4.05; 53 -1.75,4.05; 54 -2.25,4.05; 55 -2.75,4.05; 56 -3.25,4.05 | smd 4.8 x 4.8: CENTER 0,0
LQFP100 = smd 1.6 x 0.3: 1 -7.6,6; 2 -7.6,5.5; 3 -7.6,5; 4 -7.6,4.5; 5 -7.6,4; 6 -7.6,3.5; 7 -7.6,3; 8 -7.6,2.5; 9 -7.6,2; 10 -7.6,1.5; 11 -7.6,1; 12 -7.6,0.5; 13 -7.6,0; 14 -7.6,-0.5; 15 -7.6,-1; 16 -7.6,-1.5; 17 -7.6,-2; 18 -7.6,-2.5; 19 -7.6,-3; 20 -7.6,-3.5; 21 -7.6,-4; 22 -7.6,-4.5; 23 -7.6,-5; 24 -7.6,-5.5; 25 -7.6,-6; 51 7.6,-6; 52 7.6,-5.5; 53 7.6,-5; 54 7.6,-4.5; 55 7.6,-4; 56 7.6,-3.5; 57 7.6,-3; 58 7.6,-2.5; 59 7.6,-2; 60 7.6,-1.5; 61 7.6,-1; 62 7.6,-0.5; 63 7.6,0; 64 7.6,0.5; 65 7.6,1; 66 7.6,1.5; 67 7.6,2; 68 7.6,2.5; 69 7.6,3; 70 7.6,3.5; 71 7.6,4; 72 7.6,4.5; 73 7.6,5; 74 7.6,5.5; 75 7.6,6 | smd 0.3 x 1.6: 26 -6,-7.6; 27 -5.5,-7.6; 28 -5,-7.6; 29 -4.5,-7.6; 30 -4,-7.6; 31 -3.5,-7.6; 32 -3,-7.6; 33 -2.5,-7.6; 34 -2,-7.6; 35 -1.5,-7.6; 36 -1,-7.6; 37 -0.5,-7.6; 38 0,-7.6; 39 0.5,-7.6; 40 1,-7.6; 41 1.5,-7.6; 42 2,-7.6; 43 2.5,-7.6; 44 3,-7.6; 45 3.5,-7.6; 46 4,-7.6; 47 4.5,-7.6; 48 5,-7.6; 49 5.5,-7.6; 50 6,-7.6; 76 6,7.6; 77 5.5,7.6; 78 5,7.6; 79 4.5,7.6; 80 4,7.6; 81 3.5,7.6; 82 3,7.6; 83 2.5,7.6; 84 2,7.6; 85 1.5,7.6; 86 1,7.6; 87 0.5,7.6; 88 0,7.6; 89 -0.5,7.6; 90 -1,7.6; 91 -1.5,7.6; 92 -2,7.6; 93 -2.5,7.6; 94 -3,7.6; 95 -3.5,7.6; 96 -4,7.6; 97 -4.5,7.6; 98 -5,7.6; 99 -5.5,7.6; 100 -6,7.6
PROBE-16-PIN = smd 0.3 x 1.3: P$1 0,0; P$2 0.5,0; P$3 1,0; P$4 1.5,0; P$5 2,0; P$6 2.5,0; P$7 3,0; P$8 3.5,0; P$9 4,0; P$10 4.5,0; P$11 5,0; P$12 5.5,0; P$13 6,0; P$14 6.5,0; P$15 7,0; P$16 7.5,0 | smd 1.8 x 2.2: P$19 -2,-2.3; P$20 9.5,-2.3
MINIUSB5+4P-SMD-0.8-90D = smd 2.54 x 0.508: 1 0.381,-1.6; 2 0.381,-0.8; 3 0.381,0; 4 0.381,0.8; 5 0.381,1.6 | smd 2.794 x 2: P$1 6.175,4.5; P$2 6.175,-4.5; P$3 0.675,4.5; P$4 0.675,-4.5 | hole 1.016: 3.175,-2.159; 3.175,2.159
LQFP48 = smd 0.2 x 1: 1 -2.75,-4.25; 2 -2.25,-4.25; 3 -1.75,-4.25; 4 -1.25,-4.25; 5 -0.75,-4.25; 6 -0.25,-4.25; 7 0.25,-4.25; 8 0.75,-4.25; 9 1.25,-4.25; 10 1.75,-4.25; 11 2.25,-4.25; 12 2.75,-4.25; 25 2.75,4.25; 26 2.25,4.25; 27 1.75,4.25; 28 1.25,4.25; 29 0.75,4.25; 30 0.25,4.25; 31 -0.25,4.25; 32 -0.75,4.25; 33 -1.25,4.25; 34 -1.75,4.25; 35 -2.25,4.25; 36 -2.75,4.25 | smd 1 x 0.2: 13 4.25,-2.75; 14 4.25,-2.25; 15 4.25,-1.75; 16 4.25,-1.25; 17 4.25,-0.75; 18 4.25,-0.25; 19 4.25,0.25; 20 4.25,0.75; 21 4.25,1.25; 22 4.25,1.75; 23 4.25,2.25; 24 4.25,2.75; 37 -4.25,2.75; 38 -4.25,2.25; 39 -4.25,1.75; 40 -4.25,1.25; 41 -4.25,0.75; 42 -4.25,0.25; 43 -4.25,-0.25; 44 -4.25,-0.75; 45 -4.25,-1.25; 46 -4.25,-1.75; 47 -4.25,-2.25; 48 -4.25,-2.75
X4-SMD-3.2X2.5X0.7MM = smd 1.143 x 0.889: 1 -1.27,-1.016; 2 1.27,-1.016; 3 1.27,1.016; 4 -1.27,1.016

### Placement (x,y rotation side)
C1  22.05,4.06 270 top
C2  17.32,13.31 270 top
C3  17.53,11.53 270 top
C4  21.89,10.67 270 top
C5  16.31,39.88 90 top
C6  8.84,39.88 270 top
C7  21.95,9.04 90 top
C9  22.1,7.52 90 top
C11  22.2,5.89 90 top
C14  1.85,23.75 0 top
C15  22.05,21.39 0 top
C16  19.35,39.9 270 top
C17  39.93,36.37 90 top
C18  4.62,25.6 270 bottom
C19  24.03,24.87 180 top
C20  40.79,24.89 0 top
C21  34.32,24.87 0 top
C22  31.14,28.47 0 top
C23  32.72,24.87 0 top
C24  37.41,24.87 180 top
C25  37.69,44.86 0 top
C26  36.12,44.86 180 top
C27  30.3,44.88 0 top
C28  22.71,16.71 180 top
C29  21.08,15.65 180 top
C30  38.56,28.6 180 top
C31  40.28,34.39 90 top
C32  4.62,27.28 270 bottom
C33  36.73,28.35 180 top
C34  21.69,12.5 270 top
C35  22.15,1.93 270 top
D1  9.68,13.51 270 top
D2  14.66,12.29 90 top
D3  1.91,30.45 90 top
J1  3.35,14.38 0 top
J2  32.92,11.43 270 top
J3  3.81,39.62 180 top
K1  22.3,39.01 270 top
LVDS1-1  18.29,20.02 270 bottom
LVDS1-2  14.17,20.02 270 bottom
LVDS1-3  9.96,20.07 270 bottom
R1  11.58,37.64 90 top
R2  19.35,38.07 90 top
R3  22.2,31.85 0 top
R4  1.63,27.13 180 top
R5  4.57,24.08 90 bottom
R6  18.44,25.76 270 bottom
R7  12.83,12.14 0 top
R8  35.15,28.35 180 top
R9  39.93,38.15 90 top
R10  38.96,24.84 180 top
R11  25.58,24.87 180 top
R12  27.18,24.84 0 top
R13  28.75,24.84 0 top
R14  28.73,28.45 0 top
R15  35.86,24.87 0 top
R16  31.17,24.84 0 top
R17  27.23,44.88 180 top
R18  25.35,41.3 270 top
R19  25.35,39.83 270 top
R20  25.35,38.35 270 top
R21  25.35,36.86 270 top
R22  25.35,35.36 270 top
R23  25.35,33.86 270 top
R24  25.35,29.36 90 top
R25  25.35,30.86 90 top
R26  25.35,32.36 90 top
R27  28.75,44.88 180 top
R28  33.12,42.11 270 top
R29  19.46,15.65 180 top
R30  5.74,19.18 270 bottom
R31  40.41,29.87 180 top
R32  1.63,33.73 180 top
R33  22.58,27.97 90 top
R34  18.24,22.61 90 bottom
R35  14.27,22.61 90 bottom
R36  10.16,22.61 90 bottom
U1  16.81,5.03 180 top
U2  11.58,29.62 0 bottom
U$1  12.14,28.09 270 top
U$2  6.05,22 90 bottom
U$3  9.25,39.88 180 bottom
USB1  7.16,9.4 270 top
W5500-1  33.02,35.92 0 top
Y1  33.17,44.75 180 top
Y2  12.55,40.13 180 top

### Tracks (layer width: path | path; a pad name or v marks a point on that pad's centre or on a via)
+3V3  (via drill 0.51, 0.76)
  Top 0.508: C35.2 21.26,3.96 C1.2 21.44,4.06 C11.1 21.34,5.89 C9.1 21.18,7.52 C7.1 21.13,9.04 C4.2 20.8,10.67 C34.2 19.96,12.5 19.46,13.01 R29.1 | 16.89,1.93 U1.TER
  Top 0.762: R29.1 18.34,14.88 v17.53,15.7 | v40.39,27.89 40.41,27.91 R31.1 | U1.2 U1.TER | 16.89,1.93 C35.2
  Bottom 0.762: v17.53,15.7 18.14,16.31 38.1,16.31 39.01,17.22 39.01,27.28 39.32,27.58 40.39,27.58 v40.39,27.89
+5V
  Top 0.508: 7.09,11.51 6.4,10.82 5.79,10.82 5.56,10.59 USB1.1
  Top 0.762: D1.A 7.09,11.51
ACTLED
  Top 0.152: W5500-1.27 34.77,40.87 34.9,41 41.76,41 42.06,40.69 42.06,30.33 41.61,29.87 39.78,29.87 39.62,29.72 39.62,26.67 39.47,26.52 39.17,26.52 38.96,26.31 R10.2
AVCC  (via drill 0.2)
  Top 0.152: 34.29,40.19 W5500-1.28 34.29,40.15 34.29,39.17 36.29,37.17 W5500-1.21 | R27.2 R17.2 | W5500-1.17 37.83,35.17 38.1,34.9 38.1,34.29 37.98,34.17 W5500-1.15 38.07,34.17 38.41,33.83 v38.41,33.53
  Top 0.203: 34.29,40.19 34.29,41 34.9,41.6 v37.64,41.6 37.69,41.66 C25.2 | W5500-1.4 31.77,32.38 32,32.61 33.53,32.61 33.77,32.37 W5500-1.8 33.77,32.4 33.99,32.61 35.05,32.61 35.27,32.4 W5500-1.11 35.27,30.57 35.66,30.18 36.42,30.18 36.73,29.87 C33.2 37.34,29.11 37.64,29.41 38.48,29.41 C30.2 v38.56,30.79 39.55,30.79 39.7,30.63 R31.2 | R26.1 R25.1 R24.1 24.69,29.26 25.15,29.26 25.3,29.11 25.3,27.89 25.45,27.74 v27.13,27.74 | v27.13,27.74 27.13,25.65 R12.1 R13.1 | R14.1 27.53,29.21 27.13,28.8 v27.13,27.74
  Top 0.305: R18.2 24.59,45.01 v24.99,45.41 27,45.41 R17.2
  pour VCC: 24.08,51.36 49.53,51.36 49.53,-3.2 23.62,-3.2 23.62,24.69 23.62,51.36
BOOT0
  Top 0.152: U$1.94 R3.2
BOOT1
  Top 0.152: U$1.37 2.84,28.59 2.59,28.35 2.59,28.04 2.44,27.89 R4.2
CH0
  Bottom 0.152: U$3.P$16 16.75,37.2 arc90 17.07,36.88 arc-90 17.53,36.42 17.53,29.64 arc-90 16.76,28.88 U2.9 arc90 U2.9
CH1
  Bottom 0.152: U$3.P$15 16.25,36.94 arc90 16.61,36.58 arc-90 17.22,35.97 17.22,30.48 arc-90 16.61,29.87 U2.7 arc90 U2.7
CH2
  Bottom 0.152: U$3.P$14 15.75,36.83 arc90 16.31,36.27 arc-90 16.92,35.66 16.92,31.19 arc-90 16.59,30.86 U2.5 arc-90 U2.5
CH3
  Bottom 0.152: U$3.P$13 15.25,36.72 arc90 16,35.97 arc-90 16.61,35.36 16.61,32.31 arc-90 16.17,31.87 U2.3
CH4
  Bottom 0.152: U$3.P$12 14.75,36.16 arc90 15.24,35.66 arc-90 15.63,35.27 U2.1
CH12
  Bottom 0.152: U$3.P$4 10.75,36.96 arc-90 10.36,36.58 7.62,36.58 arc90 6.71,35.66 6.71,32.66 arc90 6.99,32.38 7.51,32.38 arc-90 U2.41
CH13
  Bottom 0.152: U$3.P$3 10.25,37.22 arc-90 9.91,36.88 7.32,36.88 arc90 6.4,35.97 6.4,31.7 arc90 6.71,31.39 7.5,31.39 arc-90 U2.39
CH14
  Bottom 0.152: U$3.P$2 9.75,39.78 arc90 9.75,39.78 9.75,37.49 arc-90 9.45,37.19 7.16,37.19 arc90 6.1,36.12 6.1,30.63 arc90 6.4,30.33 7.49,30.33 arc90 U2.37
CH15
  Bottom 0.152: U$3.P$1 9.25,39.83 arc90 9.3,39.78 9.3,37.8 arc-90 8.99,37.49 7.01,37.49 arc90 5.79,36.27 5.79,29.87 arc90 6.25,29.41 7.49,29.41 arc-90 U2.35
CLK  (via drill 0.2)
  Top 0.152: U$1.76 20.73,22.09 21.03,21.79 21.03,21.49 21.11,21.41 23.11,21.41 23.32,21.21 23.32,19.66 v22.56,18.9
  Bottom 0.152: J1.2 3.1,14.38 3.35,14.63 3.35,15.24 3.66,15.54 7.01,15.54 7.32,15.85 7.32,16.46 7.62,16.76 17.68,16.76 17.98,17.07 17.98,17.98 18.29,18.29 21.95,18.29 v22.56,18.9
CLK+
  Bottom 0.152: U2.21 11.83,24.44 12.5,23.77 13.26,23.77 13.51,23.52 R35.2 14.02,22.1 14.02,19.36 13.73,19.07 LVDS1-2.4
CLK-
  Bottom 0.152: U2.20 12.33,24.55 12.8,24.08 14.78,24.08 15.04,23.82 R35.1 14.33,21.89 14.33,19.36 14.62,19.07 LVDS1-2.3
CS+
  Bottom 0.152: U2.19 12.83,24.81 13.11,24.54 17.22,24.54 17.48,24.28 R34.2 17.98,22.1 17.98,19.36 17.69,19.07 LVDS1-1.4
CS-
  Bottom 0.152: U2.18 13.33,25.07 13.56,24.84 18.75,24.84 19.05,24.54 19.05,22.66 R34.1 18.29,21.89 18.29,19.36 18.58,19.07 LVDS1-1.3
DVCC  (via drill 0.2, 0.25, 0.41)  (1 unrouted)
  Top 0.152: U$1.75 18.14,19.81 18.44,19.51 21.08,19.51 v21.18,19.61 | U$1.50 4.54,20.3 v4.72,20.12 | D3.+ v3.2,29.57 | U$1.28 3.37,33.09 v3.2,32.92 | U$1.100 19.74,36.35 v20.12,36.73 R2.2 | U$1.19 9.14,34.74 8.99,34.59 8.38,34.59 8.14,34.84 U$1.21 U$1.22 7.64,38.08 v7.47,38.25 | U$1.11 13.14,37.22 13.26,37.34 17.22,37.34 v17.37,37.49
  Top 0.406: C28.2 21.59,17.48 21.08,16.97 C29.2 R29.2 19.46,17.48 v19.51,17.53
  Bottom 0.152: v11.76,21.92 11.4,21.56 LVDS1-3.1 | LVDS1-2.1 15.46,21.56 v15.7,21.79 | 19.66,20.88 LVDS1-1.1 20.51,20.96 v20.57,21.03 | U2.30 U2.31 v6.53,27.37 v6.53,27.36 5.39,27.36 C32.2 arc-90 5.47,27.37 | U$2.1 4.76,20.15 v4.72,20.12 | U2.16 U2.15 15.36,25.57 v15.55,25.76 15.55,26.28 U2.14 U2.13 | U2.26 9.33,26.4 v9.45,26.52
  Bottom 0.254: R5.2 3.2,24.08 v2.82,23.75 | R5.1 6.25,24.08 6.55,24.38 v6.55,24.84
  pour VCC: 17.53,24.23 17.53,34.9 6.86,34.9 5.33,34.9 5.33,24.23
  pour VCC: 22.56,14.63 -1.68,14.63 -1.68,41 22.56,41 22.56,36.88 22.56,35.66 5.49,35.66 4.42,35.66 4.42,23.93 4.42,23.47 17.22,23.47 22.56,23.47
GND  (via drill 0.2, 0.25, 0.41, 0.51)  (3 unrouted)
  Top 0.152: R8.1 C33.1 | C33.1 38.43,27.58 C30.1 | C33.1 36.73,26.31 C24.2 | W5500-1.14 36.29,33.67 36.12,33.83 36.12,34.67 | 36.12,34.67 36.12,35.97 36.32,36.17 | 36.12,34.67 W5500-1.16 | W5500-1.19 36.32,36.17 | 36.32,36.17 36.22,36.17 33.77,38.62 W5500-1.29 | 36.12,34.67 v35.51,34.67 | W5500-1.3 31.27,30.6 v31.39,30.48 31.39,29.49 C22.1 | U$1.27 2.37,33.59 2.29,33.68 1.07,33.68 0.76,33.38 0.76,26.52 0.91,26.36 R4.1 1.63,24.87 C14.1 | U$1.74 17.64,21.6 17.83,21.79 18.59,21.79 18.9,21.49 18.9,20.42 19.15,20.17 v20.6,20.17 | U$1.10 13.64,36.68 13.77,36.8 17.55,36.8 17.91,37.16 17.91,39.55 17.58,39.88 C5.2
  Top 0.203: C17.2 40.69,34.87 C31.2 | C17.2 R9.2 | C17.2 v40.69,39.47 | C25.1 C26.2 38.81,45.62 v38.86,45.57 | C27.2 30.3,43.61 v30.94,42.98 | R8.1 34.27,28.47 W5500-1.9 34.27,28.33 v33.83,27.89 | R19.2 R20.2 R21.2 R22.2 R23.2 23.65,33.86 v23.62,33.83 | W5500-1.48 28.8,33.17 v28.8,32.46 | v15.7,14.02 15.7,13.41 15.55,13.26 14.73,13.26 D2.- | C6.2 8.08,38.86 v8.23,38.71 8.64,38.3 U$1.20 | C5.2 v17.07,41.15 19.81,41.15 20.12,40.84 C16.1 | K1.1 22.24,42.82 v21.18,42.82 | R3.1 21.34,33.48 v21.34,33.83 21.1,33.59 U$1.99
  Top 0.254: C14.1 0.86,24.64 0.86,24.61 0.64,24.38 0.64,22.07 v0.91,21.79 | C15.1 22.05,23.52 v21.95,23.62
  Top 0.406: C20.2 40.79,21.13 v40.54,20.88 | C19.2 24.03,26.77 v24.08,26.82 | C19.1 24.03,21.23 v24.38,20.88 | R33.1 21.82,28.02 21.79,28.04 v21.79,26.82 | R33.2 23.42,28.04 v24.54,28.04 | C20.1 40.87,25.73 v40.87,26.7
  Top 0.508: USB1.5 8.76,8.84 12.19,8.84 12.19,8.72 USB1.P$3 | C2.1 18.42,12.98 C3.1 19.36,10.59 v19.36,10.21 19.1,9.96 U1.1 | C35.1 22.94,2.03 C1.1 22.96,4.09 C11.2 22.86,5.99 C9.2 22.71,7.67 C7.2 22.66,9.09 C4.1 22.58,10.74 C34.1 22.1,12.98 v22.1,14.02 | 22.56,15.8 C28.1 22.35,15.95 22.1,15.7 v22.1,14.02 | C29.1 21.84,14.88 22.1,14.63 v22.1,14.02
  Top 0.762: USB1.P$4 USB1.P$2 2.66,3.2 v7.32,3.2 7.32,3.22 USB1.P$1 11.66,8.84 12.19,8.84
  Bottom 0.152: 11.45,20.12 LVDS1-3.2 11.94,20.07 12.01,19.99 v12.01,18.19 | v16.23,18.19 16.23,19.74 16,19.96 15.51,19.96 LVDS1-2.2 | LVDS1-1.2 19.63,19.96 20.4,19.96 v20.6,20.17 | U$2.2 4.01,22 3.66,21.64 v3.66,21.49 | U2.11 14.65,27.87 v14.63,27.89 | U2.10 U2.11 | U2.12 U2.11 | U2.32 8.51,27.87 v8.53,27.89 | U2.29 8.23,26.37 v8.53,26.67 | U2.17 13.83,26.63 v13.87,26.67 | v10.36,26.67 10.36,28.4 U2.CENTER 12.65,28.55 v12.65,26.67
  Bottom 0.203: C32.1 v2.9,27.28
  Bottom 0.254: R6.1 16.61,25.76 v16.46,25.6 | R6.2 21.03,25.76 v21.34,25.45
  Bottom 0.406: C32.1 C18.1
  pour GND: 24.84,21.49 50.9,21.49 50.9,-2.74 23.75,-2.74 23.75,14.61 23.75,21.49
  pour GND: 26.97,50.75 51.36,50.75 51.36,25.76 51.36,23.01 25.6,23.01 23.32,23.01 23.32,34.59 23.32,50.75
  pour GND: 17.53,34.9 17.53,24.23 2.59,24.23 2.59,40.69 5.33,40.69 5.33,34.9
  pour GND: 22.56,14.33 22.56,-1.68 -0.46,-1.68 -0.46,23.16 19.05,23.16 19.05,36.27 17.07,36.27 7.32,36.27 7.32,49.07 22.56,49.07
LINKLED  (via drill 0.2)
  Top 0.152: W5500-1.25 36.34,40.17 v36.58,39.93 | v25.6,26.98 25.6,25.65 R11.2
  Bottom 0.152: v36.58,39.93 36.58,29.87 35.97,29.26 25.91,29.26 25.6,28.96 v25.6,26.98
MISO+
  Bottom 0.152: 6.1,22.86 6.1,23.32 6.4,23.62 7.16,23.62 7.32,23.77 7.32,24.54 7.47,24.69 9.6,24.69 9.83,24.92 U2.25 | 6.1,22.86 6.1,20.3 R30.1 | U$2.3 4.84,22.86 6.1,22.86
MISO-
  Bottom 0.152: R30.2 6.55,19.23 6.55,22.71 6.79,22.95 U$2.4 7.77,23.37 7.77,24.08 7.93,24.23 9.91,24.23 10.33,24.66 U2.24
MOSI+
  Bottom 0.152: U2.23 10.83,23.79 10.21,23.16 10.21,22.86 9.96,22.61 R36.2 9.91,22.1 9.91,19.36 9.67,19.12 LVDS1-3.4
MOSI-
  Bottom 0.152: U2.22 11.33,23.52 10.92,23.11 R36.1 10.36,22.05 10.36,19.36 10.6,19.12 LVDS1-3.3
N$1
  Top 0.152: U$1.73 17.14,19.43 17.53,19.05 21.64,19.05 22.05,19.46 C15.2
N$4
  Top 0.508: D1.C 12.38,15.51 12.8,15.09 12.8,12.93 R7.1 12.83,14.94 16,14.94 16.56,14.38 C2.2 16.64,13.23 C3.2 16.64,10.54 16.31,10.21 14.94,10.21 14.53,9.8 U1.3
N$5
  Top 0.152: W5500-1.23 37.29,38.15 R9.1
N$6
  Top 0.152: C17.1 37.87,37.67 W5500-1.22
N$7
  Top 0.152: C31.1 38.25,35.53 38.25,36.42 38.01,36.67 W5500-1.20
N$8
  Top 0.152: U$1.49 2.12,22.59 C14.2
N$9
  Top 0.203: J2.G- 28.85,8.74 30.18,10.06 30.18,13.11 25.58,17.7 R11.1
N$10
  Top 0.203: J2.Y- 36.98,8.89 35.66,10.21 35.66,13.56 38.96,16.87 R10.1
N$11
  Top 0.152: W5500-1.45 27.96,34.67 27.89,34.59 27.89,31.14 R24.2
N$12
  Top 0.152: R7.2 14.63,11.38 D2.+
N$13
  Top 0.152: W5500-1.10 34.77,30.3 35.2,29.87 35.2,29.16 R8.2
N$14
  Top 0.152: W5500-1.44 27.7,35.17 27.58,35.05 27.58,32.33 R25.2
N$15
  Top 0.152: C21.2 34.29,24.08 34.29,23.32 35.36,22.25 35.36,21.34 35.81,20.88 35.81,19.81 35.2,19.2 32.77,19.2 31.34,17.78 J2.RD+
N$16  (via drill 0.2)
  Top 0.152: R14.2 28.73,26.75 v28.8,26.67 | v30.94,26.67 31.14,26.87 C22.2
  Bottom 0.152: v28.8,26.67 v30.94,26.67 30.94,22.86 32.28,21.51 J2.P4
N$17
  Top 0.152: W5500-1.43 27.44,35.67 27.28,35.51 27.28,33.53 R26.2
N$18
  Top 0.152: C23.2 32.89,24.11 34.82,22.17 J2.RD-
N$19
  Top 0.152: W5500-1.31 32.77,41.7 R28.2 32.36,43.28 Y1.3
  Top 0.203: Y1.3 31.9,44.04 C27.1
N$20
  Top 0.152: W5500-1.38 27.21,38.17 26.98,38.41 26.98,38.96 R19.1
N$21
  Top 0.152: J2.P5 34.37,18.59 35.36,18.59 35.66,18.9 35.97,18.9 36.27,19.2 36.27,21.49 37.41,22.63 C24.1 R15.2 35.87,24.33 35.36,24.84 31.93,24.84 R16.2
N$22
  Top 0.152: W5500-1.39 26.8,37.67 R20.1
N$23
  Top 0.152: W5500-1.40 26.42,37.17 R21.1
N$24
  Top 0.152: W5500-1.41 27.06,36.67 26.98,36.58 26.98,36.22 R22.1
N$25
  Top 0.152: W5500-1.42 27.48,36.17 26.98,35.66 26.98,34.72 R23.1
N$26
  Top 0.152: R32.1 1.63,31.62 D3.-
N$27
  Top 0.152: W5500-1.30 33.27,41.5 R28.1 | R28.1 33.22,42.77 33.22,44.5 34.44,45.72 Y1.1 | R28.1 35.26,42.11 36.12,42.98 C26.1
N$28
  Top 0.152: U$1.24 6.64,34.84 6.4,34.59 1.73,34.59 R32.2
N$30
  Bottom 0.152: U2.28 5.42,25.57 arc-90 C18.2
N$36
  Bottom 0.152: 8.38,29.87 8.38,29.11 8.14,28.87 U2.34 5.58,28.87 5.03,29.41 5.03,41.76 4.72,42.06 3.91,42.06 J3.3 | 8.38,29.87 8.38,30.87 | 8.38,30.87 8.38,31.87 | 8.38,31.87 8.38,32.61 | 8.38,32.61 8.13,32.87 U2.42 | U2.44 8.83,33.08 9.14,32.77 | 9.83,32.77 10.83,32.77 | 10.83,32.77 11.83,32.77 | 11.83,32.77 12.83,32.77 | 12.83,32.77 13.83,32.77 | 13.83,32.77 14.48,32.77 | 14.48,32.77 14.83,33.12 U2.56 | U2.2 14.99,32.37 14.78,32.16 | 14.78,32.16 14.78,31.39 | 14.78,31.39 14.78,30.33 | 14.78,30.33 14.78,29.57 14.98,29.37 U2.8 | U2.36 8.38,29.87 | U2.38 8.38,30.87 | U2.40 8.38,31.87 | U2.46 9.83,32.77 | 9.83,32.77 9.14,32.77 | U2.48 10.83,32.77 | U2.50 11.83,32.77 | U2.52 12.83,32.77 | U2.54 13.83,32.77 | U2.6 15.63,30.33 14.78,30.33 | U2.4 15.63,31.39 14.78,31.39 | 14.48,32.77 14.78,32.46 14.78,32.16 | 8.38,32.61 8.53,32.77 9.14,32.77
N$37
  Bottom 0.152: U$3.P$11 14.25,36.05 arc90 14.33,35.97 arc-90 14.33,35.96 U2.55
N$38
  Bottom 0.152: U$3.P$10 13.75,35.08 arc-90 13.56,34.9 arc90 13.33,34.67 U2.53
N$39
  Bottom 0.152: U$3.P$9 13.25,35.34 arc-90 12.95,35.05 12.65,35.05 arc90 12.34,34.75 U2.51 arc-90 U2.51
N$40
  Bottom 0.152: U$3.P$8 12.75,35.76 arc-90 12.34,35.36 11.71,35.36 arc90 11.35,35 11.35,33.69 arc-90 U2.49
N$41
  Bottom 0.152: U$3.P$7 12.25,36.02 arc-90 11.89,35.66 10.67,35.66 arc90 10.36,35.36 10.36,33.7 arc-90 U2.47
N$42
  Bottom 0.152: U$3.P$6 11.75,36.28 arc-90 11.43,35.97 9.73,35.97 arc90 9.37,35.61 9.37,33.71 arc-90 U2.45
N$43
  Bottom 0.152: U$3.P$5 11.25,36.54 arc-90 10.97,36.27 8.84,36.27 arc90 8.38,35.81 8.38,33.72 arc-90 U2.43
OSC_IN
  Top 0.152: C5.1 15.09,39.88 Y2.1 12.65,41.15 12.34,40.84 R1.2 12.34,37.03 12.64,36.74 U$1.12
OSC_OUT
  Top 0.152: C6.1 10.52,39.88 Y2.3 10.82,38.66 R1.1 10.82,37.03 10.97,36.88 11.89,36.88 12.14,36.63 U$1.13
RST
  Top 0.152: U$1.14 11.64,34.84 11.89,34.59 18.44,34.59 18.75,34.9 18.75,37.92 R2.1 18.59,39.01 | 18.59,39.01 C16.2 | K1.2 22.3,38.66 21.95,39.01 18.59,39.01
RXD1
  Top 0.152: J1.5 5.54,14.38 5.79,14.63 5.79,17.07 6.25,17.53 12.34,17.53 13.26,18.44 14.63,18.44 15.14,18.95 U$1.69
RXN
  Top 0.152: W5500-1.5 32.27,27.32 32.77,26.82 32.77,25.68 C23.1 31.19,25.63 R16.1
RXP
  Top 0.152: W5500-1.6 32.77,27.44 32.77,27.43 33.53,26.67 33.53,26.42 C21.1 R15.1
SPI2_CLK  (via drill 0.2)
  Top 0.152: U$1.52 6.64,22.19 7.01,22.55 8.23,22.55 8.53,22.25 11.13,22.25 11.43,22.55 12.19,22.55 v12.5,22.25
  Bottom 0.152: LVDS1-2.5 12.87,21.87 v12.5,22.25
SPI2_CS  (via drill 0.2)
  Top 0.152: U$1.51 6.14,22.6 6.55,23.01 8.23,23.01 8.38,22.86 12.95,22.86 13.72,22.1 14.94,22.1 15.24,22.4 16.15,22.4 v16.46,22.1
  Bottom 0.152: LVDS1-1.5 16.99,21.57 v16.46,22.1
SPI2_MISO  (via drill 0.2)
  Top 0.152: v7.32,21.95 7.14,21.77 U$1.53
  Bottom 0.152: U$2.5 7.35,21.95 v7.32,21.95
SPI2_MOSI  (via drill 0.2)
  Top 0.152: v7.62,19.05 7.62,20.49 U$1.54
  Bottom 0.152: LVDS1-3.5 8.66,20.09 8.53,19.96 8.08,19.96 7.77,19.66 7.77,19.2 v7.62,19.05
SWD  (via drill 0.2)
  Top 0.152: v13.41,17.53 14.63,17.53 15.85,18.75 16.31,18.75 16.64,19.08 U$1.72
  Bottom 0.152: J1.1 2.08,17.93 2.44,18.29 10.82,18.29 11.58,17.53 v13.41,17.53
TXD1
  Top 0.152: U$1.68 14.64,19.37 14.33,19.05 12.04,19.05 11.43,18.44 5.18,18.44 4.62,17.88 J1.6
TXN
  Top 0.152: W5500-1.1 30.27,30.73 29.72,30.18 29.72,24.08 | 29.72,24.08 29.72,20.34 J2.TD- | R13.2 29.72,24.08
TXP
  Top 0.152: W5500-1.2 30.77,30.62 30.18,30.02 30.18,21.95 30.94,21.18 30.94,19.51 30.48,19.05 30.02,19.05 28.75,17.78 J2.TD+ 27.18,19.07 R12.2
W5500_CLK  (via drill 0.2)
  Top 0.152: U$1.30 18.22,32.09 v18.29,32.16 | v32,37.49 31.77,37.72 W5500-1.33
  Bottom 0.152: v18.29,32.16 25.91,32.16 27.13,33.38 27.13,37.19 27.43,37.49 v32,37.49
W5500_CS  (via drill 0.2)
  Top 0.152: R27.1 28.8,44.07 28.8,43.28 28.96,43.13 29.87,43.13 31.7,41.3 32,41.3 32.27,41.03 W5500-1.32 32.27,38.6 v32.46,38.41 | U$1.29 17.91,32.59 18.21,32.89 v18.21,33.17
  Bottom 0.152: v18.21,33.17 25.86,33.17 26.37,33.68 26.37,37.8 26.98,38.41 v32.46,38.41
W5500_INT
  Top 0.152: R17.1 27.23,43.18 27.74,42.67 29.41,42.67 30.27,41.81 30.27,40.69 30.27,40.54 | 30.27,40.54 W5500-1.36 | U$1.25 6.14,41.65 6.55,42.06 20.88,42.06 21.34,41.6 21.34,40.84 21.64,40.54 30.27,40.54
W5500_MISO  (via drill 0.2)
  Top 0.152: U$1.31 17.94,31.59 v18.14,31.39 | v31.39,36.73 31.27,36.85 W5500-1.34
  Bottom 0.152: v18.14,31.39 25.91,31.39 27.58,33.07 27.58,36.58 27.74,36.73 v31.39,36.73
W5500_MOSI  (via drill 0.2)
  Top 0.152: U$1.32 17.52,31.09 v18.14,30.48 | v30.79,36.12 30.77,36.13 W5500-1.35
  Bottom 0.152: v18.14,30.48 26.06,30.48 28.04,32.46 28.04,35.81 28.35,36.12 v30.79,36.12
W5500_RST  (via drill 0.2)
  Top 0.152: v28.8,39.62 28.8,38.7 W5500-1.37 | U$1.26 18.18,34.09 v18.29,33.98 | v28.5,41.3 R18.1
  Bottom 0.152: 22.4,39.17 22.86,39.62 v28.8,39.62 28.8,41 v28.5,41.3
  Bottom 0.203: v18.29,33.98 19.05,34.75 21.34,34.75 22.4,35.81 22.4,39.17

### Text on the board
tPlace: GND | GND | RXD | CLK | TXD | SWD
tStop: BMI-V2